# Altium schematic sheet RF.SchDoc
size A4; SheetNumber: 4; SheetTotal: 5
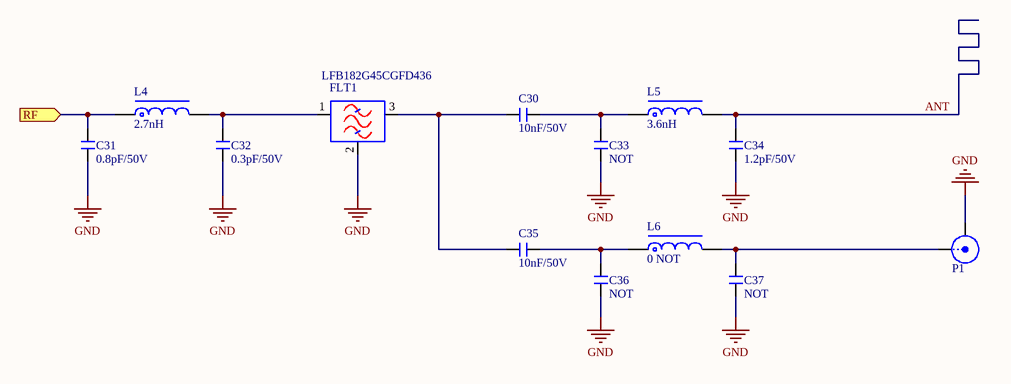
[diagram p0: RF.SchDoc]

## Parts
C30  10nF/50V  [C 0402_L]
C31  0.8pF/50V  [C 0402_L]
C32  0.3pF/50V  [C 0402_L]
C33  NOT  [C 0402_L]
C34  1.2pF/50V  [C 0402_L]
C35  10nF/50V  [C 0402_L]
C36  NOT  [C 0402_L]
C37  NOT  [C 0402_L]
FLT1  LFB182G45CGFD436  [LFB182G45CGFD436]
L4  2.7nH  [L 0402]
L5  3.6nH  [L 0402]
L6  0 NOT  [L 0402]
P1  SMB  [PCBComponent_1 - duplicate]  (value not drawn)

## Ports
RF (in)

## Nets
GND: C31.2 C32.2 C33.2 C34.2 C36.2 C37.2 FLT1.2(GND) P1.2(Y)
ANT: C34.1 L5.2
RF: C31.1 L4.1 ; port RF
NetC30_1: C30.1 C35.1 FLT1.3(I/O)
NetC30_2: C30.2 C33.1 L5.1
NetC32_1: C32.1 FLT1.1(I/O) L4.2
NetC35_2: C35.2 C36.1 L6.1
NetC37_1: C37.1 L6.2 P1.1(X)

## Library data of the parts
C30 C35 = C: 贴片电容; 主类型: 电容; 值精度: ±5%; 元件封装: 0402; 具体类型: 陶瓷电容; 封装类型: 贴片; 温度漂移: X7R（10%）; 温度范围: -55°C ~ 125°C; 生产商: YAGEO(国巨); 生产商零件编码: CC0402JRX7R9BB103; 值/型号: 10nF/50V; 立创编号: C272878
C31 = C: 贴片电容; 主类型: 电容; 值精度: ±0.05pF; 元件封装: 0402; 具体类型: 陶瓷电容; 封装类型: 贴片; 温度漂移: X7R（10%）; 温度范围: -55°C ~ 125°C; 生产商: muRata(村田); 生产商零件编码: GJM1555C1HR80WB01D; 值/型号: 0.8pF/50V; 立创编号: C88902
C32 = C: 贴片电容; 主类型: 电容; 值精度: ±0.05pF; 元件封装: 0402; 具体类型: 陶瓷电容; 封装类型: 贴片; 温度漂移: X7R（10%）; 温度范围: -55°C ~ 125°C; 生产商: muRata(村田); 生产商零件编码: GJM1555C1HR30WB01D; 值/型号: 0.3pF/50V; 立创编号: C76909
C33 C36 C37 = C: 贴片电容; 主类型: 电容; 值/型号: 22uF/16V; 值精度: ±10%; 元件封装: 0805; 具体类型: 陶瓷电容; 封装类型: 贴片; 温度漂移: X7R（10%）; 温度范围: -55°C ~ 125°C; 生产商: SAMSUNG(三星); 生产商零件编码: CL21A226KOQNNNE; 立创编号: C296720
C34 = C: 贴片电容; 主类型: 电容; 值精度: ±0.05pF; 元件封装: 0402; 具体类型: 陶瓷电容; 封装类型: 贴片; 温度漂移: X7R（10%）; 温度范围: -55°C ~ 125°C; 生产商: muRata(村田); 生产商零件编码: GJM1555C1H1R2WB01D; 值/型号: 1.2pF/50V; 立创编号: C76899
FLT1 = LFB182G45CGFD436: Band Pass Filter Murata LFB182G45CGFD436; 主类型: 电感; 元件封装: 0603; 具体类型: 滤波电感; 封装类型: 贴片; 生产商: muRata(村田); 值/型号: LFB182G45CGFD436; 生产商零件编码: LFB182G45CGFD436
L4 = L-CD: LQG15HS2N7S02; 主类型: 电感; 元件封装: 0402; 具体类型: 贴片电感; 封装类型: 贴片; 温度范围: -40-125; 生产商: muRata(村田); 生产商零件编码: LQG15HS2N7S02D; 值/型号: LQG15HS2N7S02; 立创编号: C77108
L5 = L-CD: LQG15HS3N6S02; 主类型: 电感; 元件封装: 0402; 具体类型: 贴片电感; 封装类型: 贴片; 温度范围: -40-125; 生产商: muRata(村田); 生产商零件编码: LQG15HS3N6S02D; 值/型号: LQG15HS3N6S02; 立创编号: C19216
L6 = L-CD: 主类型: 电感; 元件封装: 4020; 具体类型: 功率电感; 封装类型: 贴片; 温度范围: -40-125; 生产商: Coilcraft; 生产商零件编码: XFL4020-222MEB; 类型备注: 淘宝采购; 立创编号: https://detail.tmall.com/item.htm?spm=a230r.1.14.16.717a6f292tX0SR&id=619184428761&ns=1&abbucket=12
P1 = SMB: SMB Straight Connector